# Altium schematic sheet sd_debug.SchDoc
size A3; Hw_rev: 0; License: GPLv3; Address3: Firenze; Address4: ITALY; DocumentNumber: 5; Revision: 0; SheetNumber: 5; SheetTotal: 8
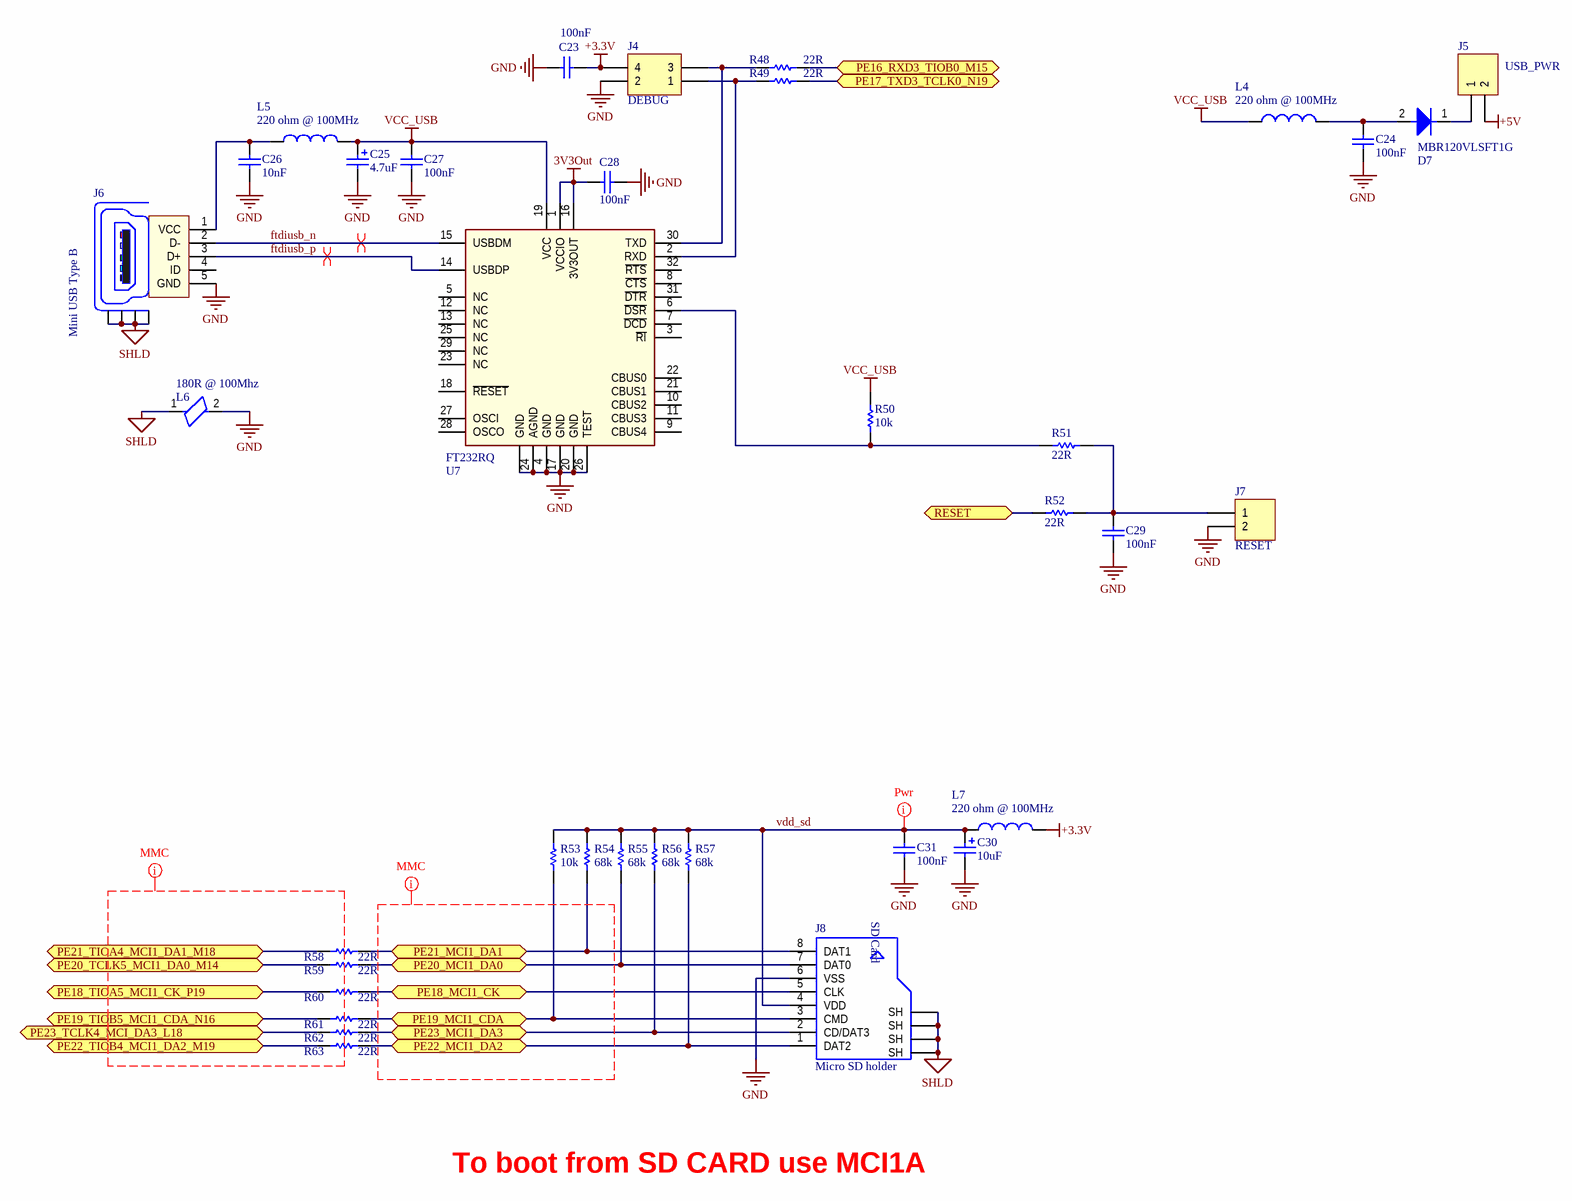
[diagram p0: sd_debug.SchDoc]

## Parts
C23  100nF  [0603_[1608]]
C24  100nF  [0603_[1608]]
C25  4.7uF  [1206_[3216]]
C26  10nF  [0603_[1608]]
C27  100nF  [0603_[1608]]
C28  100nF  [0603_[1608]]
C29  100nF  [0603_[1608]]
C30  10uF  [1206_[3216]]
C31  100nF  [0603_[1608]]
D7  MBR120VLSFT1G  [SOD-123]
J4  DEBUG  [HEADER_2X2_2.54MM_THD]
J5  USB_PWR  [HEADER_1X2_2.54MM_THD]
J6  Mini USB Type B  [usb_typeB_mini_smd]
J7  RESET  [HEADER_1X2_2.54MM_THD]
J8  Micro SD holder  [micro_sd_holder_pp]
L4  220 ohm @ 100MHz  [0805_[2012]]
L5  220 ohm @ 100MHz  [0805_[2012]]
L6  180R @ 100Mhz  [0603_[1608]]
L7  220 ohm @ 100MHz  [0805_[2012]]
R48  22R  [0603_[1608]]
R49  22R  [0603_[1608]]
R50  10k  [0603_[1608]]
R51  22R  [0603_[1608]]
R52  22R  [0603_[1608]]
R53  10k  [0603_[1608]]
R54  68k  [0603_[1608]]
R55  68k  [0603_[1608]]
R56  68k  [0603_[1608]]
R57  68k  [0603_[1608]]
R58  22R  [0603_[1608]]
R59  22R  [0603_[1608]]
R60  22R  [0603_[1608]]
R61  22R  [0603_[1608]]
R62  22R  [0603_[1608]]
R63  22R  [0603_[1608]]
U7  FT232RQ  [QFN-32]

## Ports
PE16_RXD3_TIOB0_M15, PE17_TXD3_TCLK0_N19, PE18_MCI1_CK, PE18_TIOA5_MCI1_CK_P19, PE19_MCI1_CDA, PE19_TIOB5_MCI1_CDA_N16, PE20_MCI1_DA0, PE20_TCLK5_MCI1_DA0_M14, PE21_MCI1_DA1, PE21_TIOA4_MCI1_DA1_M18, PE22_MCI1_DA2, PE22_TIOB4_MCI1_DA2_M19, PE23_MCI1_DA3, PE23_TCLK4_MCI_DA3_L18, RESET

## Nets
3V3Out: C28.1 U7.1(VCCIO) U7.16(3V3OUT)
+3.3V: C23.1 J4.4 L7.1
+5V: J5.2
GND: C23.2 C24.1 C25.2 C26.2 C27.2 C28.2 C29.1 C30.2 C31.2 J4.2 J6.5(GND) J7.2 J8.6(VSS) L6.2 U7.4(GND) U7.17(GND) U7.20(GND) U7.24(AGND) U7.26(TEST) U7.GND_PAD(GND)
SHLD: J6.Z1(Shield) J6.Z2(Shield) J6.Z3(Shield) J6.Z4(Shield) J8.Z1(SH) J8.Z2(SH) J8.Z3(SH) J8.Z4(SH) L6.1
VCC_USB: C25.1 C27.1 L4.2 L5.1 R50.1 U7.19(VCC)
ftdiusb_n: J6.2(D-) U7.15(USBDM)
ftdiusb_p: J6.3(D+) U7.14(USBDP)
PE16_RXD3_TIOB0_M15: R48.1 ; port PE16_RXD3_TIOB0_M15
PE17_TXD3_TCLK0_N19: R49.1 ; port PE17_TXD3_TCLK0_N19
PE18_MCI1_CK: J8.5(CLK) R60.2 ; port PE18_MCI1_CK
PE18_TIOA5_MCI1_CK_P19: R60.1 ; port PE18_TIOA5_MCI1_CK_P19
PE19_MCI1_CDA: J8.3(CMD) R53.2 R61.2 ; port PE19_MCI1_CDA
PE19_TIOB5_MCI1_CDA_N16: R61.1 ; port PE19_TIOB5_MCI1_CDA_N16
PE20_MCI1_DA0: J8.7(DAT0) R55.2 R59.2 ; port PE20_MCI1_DA0
PE20_TCLK5_MCI1_DA0_M14: R59.1 ; port PE20_TCLK5_MCI1_DA0_M14
PE21_MCI1_DA1: J8.8(DAT1) R54.2 R58.2 ; port PE21_MCI1_DA1
PE21_TIOA4_MCI1_DA1_M18: R58.1 ; port PE21_TIOA4_MCI1_DA1_M18
PE22_MCI1_DA2: J8.1(DAT2) R57.2 R63.2 ; port PE22_MCI1_DA2
PE22_TIOB4_MCI1_DA2_M19: R63.1 ; port PE22_TIOB4_MCI1_DA2_M19
PE23_MCI1_DA3: J8.2(CD/DAT3) R56.2 R62.2 ; port PE23_MCI1_DA3
PE23_TCLK4_MCI_DA3_L18: R62.1 ; port PE23_TCLK4_MCI_DA3_L18
RESET: R52.2 ; port RESET
vdd_sd: C30.1 C31.1 J8.4(VDD) L7.2 R53.1 R54.1 R55.1 R56.1 R57.1
NetC24_2: C24.2 D7.2(A) L4.1
NetC26_1: C26.1 J6.1(VCC) L5.2
NetC29_2: C29.2 J7.1 R51.1 R52.1
NetD7_1: D7.1(K) J5.1
NetJ4_1: J4.1 R49.2 U7.2(RXD)
NetJ4_3: J4.3 R48.2 U7.30(TXD)
NetR50_2: R50.2 R51.2 U7.6(~{DSR})

Not connected (* = marked no-connect by the designer): J6 4(ID); U7 3(~{RI}) 5(NC) 7(~{DCD}) 8(~{CTS}) 9(CBUS4) 10(CBUS2) 11(CBUS3) 12(NC) 13(NC) 18(~{RESET}) 21(CBUS1) 22(CBUS0) 23(NC) 25(NC) 27(OSCI) 28(OSCO) 29(NC) 31(~{DTR}) 32(~{RTS})

## Layout directives
differential pair: ftdiusb_n, ftdiusb_p
net class mmc: (no net found under the mark)
net class mmc_con: (no net found under the mark)
net class Power: vdd_sd

## Notes on the sheet
- To boot from SD CARD use MCI1A
- Title:
- File:
- License:
- asterix24@gmail.com
- Ing. Daniele Basile
- Rev:
- Date:
- Time:
- Sheet
- of
- (in symbol micro_sd_holde) SD Card

## Library data of the parts
C23 C24 C27-C29 = Cap: Ceramic X7R 50V; Value: 10nF; Published: 8-Jun-2000; Revision: July-2002: Re-released for DXP Platform.; Publisher: Altium Limited
C25 = Cap Pol1: Ceramic X5R 25V; Value: 10uF; Published: 8-Jun-2000; Revision: July-2002: Re-released for DXP Platform.; Publisher: Altium Limited
C26 = Cap: Ceramic X7R 50V; Published: 8-Jun-2000; Revision: July-2002: Re-released for DXP Platform.; Publisher: Altium Limited; Value: 10nF
C30 = Cap Pol1: Ceramic X5R 25V; Published: 8-Jun-2000; Revision: July-2002: Re-released for DXP Platform.; Publisher: Altium Limited; Value: 10uF
C31 = Cap: Ceramic X7R 50V; Value: 100pF; Published: 8-Jun-2000; LatestRevisionDate: 17-Jul-2002; LatestRevisionNote: Re-released for DXP Platform.; PackageReference: RAD-0.3; Publisher: Altium Limited; PackageDescription: Radial Cap, Thru-Hole; 2 Leads; 0.3 in Pin Spacing
D7 = Diode: Diode Schottky  low Vf, If 1A (PMEG3010ER; MBRX120LF)
J4 = Header 2X2: Pin Header, 4pin, 2x2, 2.54mm, THD; LatestRevisionDate: 17-Jul-2002; LatestRevisionNote: Re-released for DXP Platform.; Publisher: Altium Limited
J5 J7 = Header 2: Pin Header, 2pin, 1x2, 2.54mm, THD; LatestRevisionDate: 17-Jul-2002; LatestRevisionNote: Re-released for DXP Platform.; Publisher: Altium Limited
J6 = USB_Con_Type_B_mini_SMT: Mini USB SMT Type B 5 Contacts (WE 65100516121); Manufacturer: Würth Elektronik eiSos GmbH; ComponentLink1 Description: Manufacturer; ComponentLink2 Description: Datasheet; NoPins: 5; ComponentLink1URL: http://www.we-online.de; ComponentLink2URL: http://katalog.we-online.de/em/datasheet/65100516121.pdf; Created by: Karrer Zheng; Created Date: 10/10/2014; partNo: 65100516121
J8 = micro_sd_holde: WR-CRD Micro SD_Push and Push (693071010811); Manufacturer: Würth Elektronik eiSos GmbH; ComponentLink1 Description: Manufacturer; ComponentLink2 Description: Datasheet; NoPins: 8; ComponentLink1URL: http://www.we-online.de; ComponentLink2URL: http://katalog.we-online.de/em/datasheet/693071010811.pdf; Created by: Karrer Zheng; Created Date: 10/10/2014; partNo: 693071010811
L4 L5 L7 = Inductor: WE 742792022
L6 = BEAD_ FERRITE: Ferrite Beat (WE 7427927218)
R48-R63 = Res1: Resistor; Value: 1K; Published: 8-Jun-2000; Revision: July-2002: Re-released for DXP Platform.; Publisher: Altium Limited
U7 = FT232RQ: Serial TTL 232 <-> USB (QFN-32)